# Altium schematic sheet ring_v3.SchDoc
size A
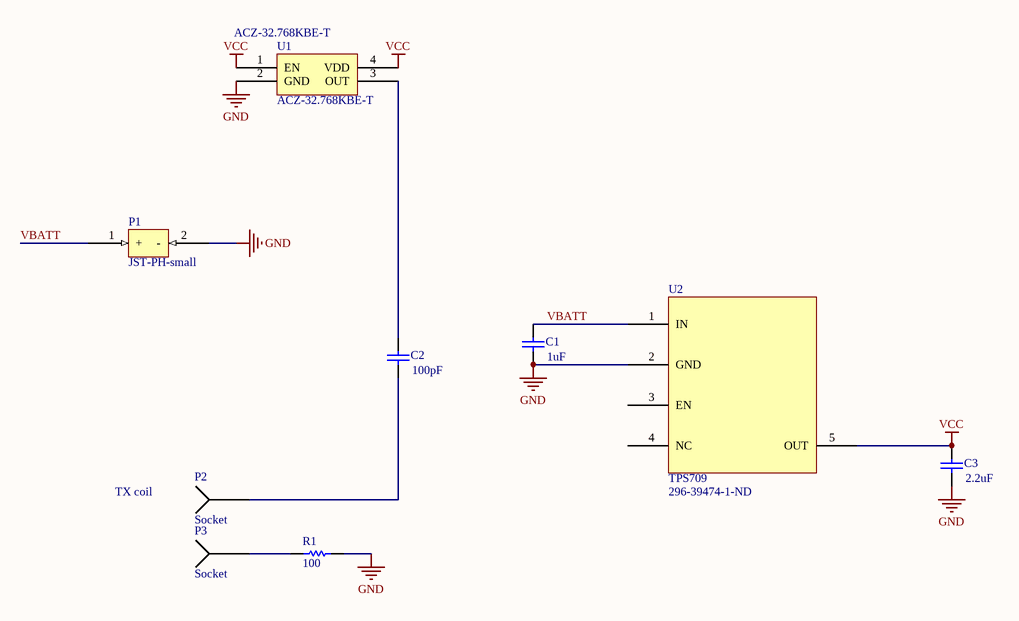
[diagram p0: ring_v3.SchDoc]

## Parts
C1  value 1uF  [0402]  (hidden comment: Cap)
C2  value 100pF  [0402]  (hidden comment: Cap)
C3  value 2.2uF  [0402]  (hidden comment: Cap)
P1  JST-PH-small  [JST-PH-small]
P2  Socket  [socket]
P3  Socket  [socket]
R1  value 100  [0402]  (hidden comment: Res)
U1  ACZ-32.768KBE-T  [ACZ-32.768KBE-T]
U2  TPS709  Supplier Part Number 1: 296-39474-1-ND  [SOT95P280X145-5N]

## Nets
GND: C1.1 C3.1 P1.2(-) R1.2 U1.2(GND) U2.2(GND)
VCC: C3.2 U1.1(EN) U1.4(VDD) U2.5(OUT)
VBATT: C1.2 P1.1(+) U2.1(IN)
NetC2_1: C2.1 P2.0
NetC2_2: C2.2 U1.3(OUT)
NetP3_0: P3.0 R1.1

Not connected (* = marked no-connect by the designer): U2 3(EN) 4(NC)

## Notes on the sheet
- TX coil

## Library data of the parts
C1-C3 = Cap: Ceramic Capacitor (Surface Mount); Manufacturer: Generic Ceramic Chip Cap (TBD); Digi-Key Part Number: *; Manufacturer Part Number: *; Note: *; Rating: *
R1 = Res: Chip Resistor (Surface Mount); Manufacturer: Generic Chip Res (TBD); Manufacturer Part Number: *; Digi-Key Part Number: *; Rating: *
U1 = ACZ-32.768KBE-T: 32.768kHz XO (Standard) CMOS Oscillator 3.3V Enable/Disable 4-SMD, No Lead; ComponentLink1Description: Digi-Key; ComponentLink1URL: https://www.digikey.com/product-detail/en/ACZ-32.768KBE-T/887-1670-2-ND/3454688?utm_campaign=buynow&WT.z_cid=ref_octopart_dkc_buynow&utm_medium=aggregator&curr=usd&site=us&utm_source=octopart; ComponentLink2Description: Datasheet; ComponentLink2URL: http://www.txccrystal.com/images/pdf/acz.pdf; Supplier 1: Arrow; Supplier Part Number 1: ACZ-32.768KBE-T
U2 = TPS70933: 3.3V Ultra low power Voltage Regulator; Supplier 1: Digi-Key